# EasyEDA schematic Class AB.json
TITLE: 3T Class AB Audio Amp; REV: 1.0; Date: 2020-02-13; Sheet: 1/1; Drawn By: Ezra W. Wolf; Company: n/a
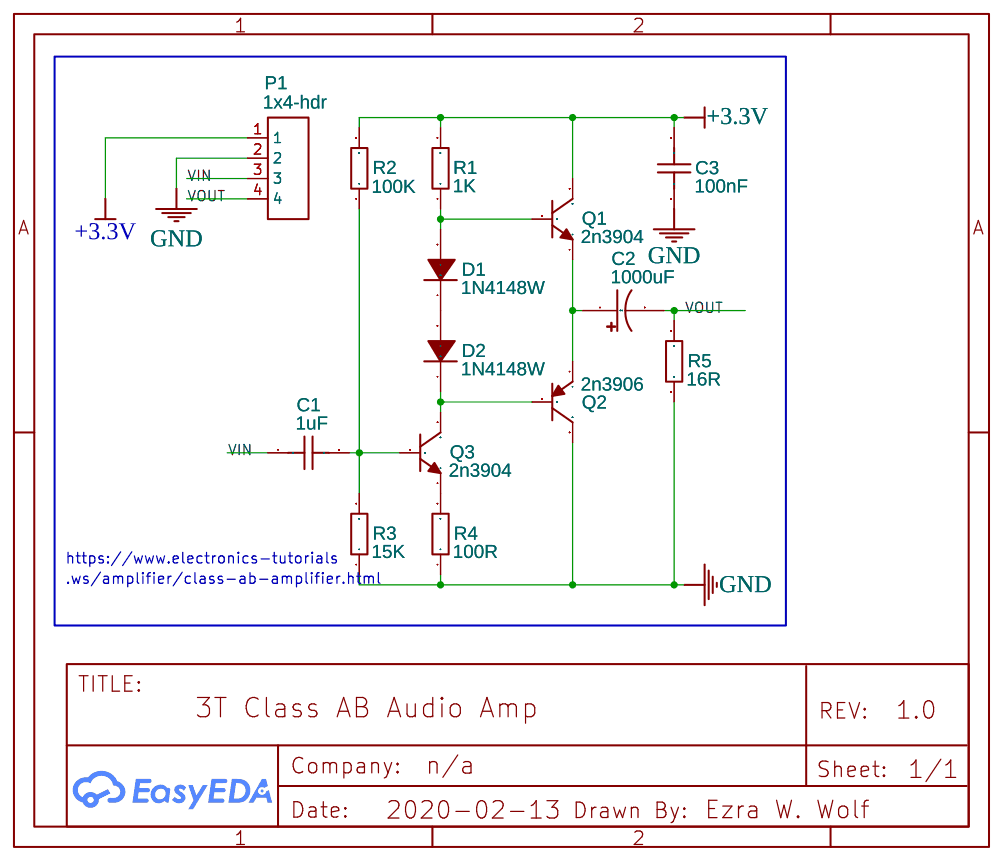
[diagram p0: schematic sheet]

## Parts
#1  -
C1  1uF  [C0603]
C2  1000uF  [CAP-SMD_BD10.0-L10.3-W10.3-FD]
C3  100nF  [C0603]
D1  1N4148W  [SOD-123_L2.8-W1.8-LS3.7-RD]
D2  1N4148W  [SOD-123_L2.8-W1.8-LS3.7-RD]
P1  1x4-hdr  [1X4-HDR]
Q1  2n3904  [SOT-23-3_L2.9-W1.3-P1.90-LS2.4-TR]
Q2  2n3906  [SOT-23-3_L2.9-W1.6-P1.90-LS2.8-TR-CW]
Q3  2n3904  [SOT-23-3_L2.9-W1.3-P1.90-LS2.4-TR]
R1  1K  [R0603]
R2  100K  [R0603]
R3  15K  [R0603]
R4  100R  [R0603]
R5  16R  [R0603]

## Library data of the parts
#1 = -: BOM_Manufacturer Part: ?
C1 = GRM188B31C105KA92D: Supplier: LCSC; Manufacturer: MuRata; Supplier Part: C85993
C2 = VEU102M0J1010-TRO: Supplier: LCSC; Supplier Part: C249735; Manufacturer: Lelon; Contributor: LCSC
C3 = 0603B104M500CT: Supplier: LCSC; Supplier Part: C388001; Manufacturer: Walsin Tech Corp; Contributor: LCSC
D1 D2 = 1N4148W_C109203: Supplier: LCSC; Supplier Part: C109203; Manufacturer: SK; Contributor: LCSC
P1 = 1x4-hdr: Contributor: Ezra Wolf
Q1 Q3 = 2n3904S-RTK/PS_C18536: Supplier: LCSC; Manufacturer: KEC; Manufacturer Part: 2n3904S-RTK/PS; image: //image.lceda.cn/szlcsc/C18536.jpg; Supplier Part: C18536; LCSC Assembly: Yes; SMT Type: Basic
Q2 = 2N3906S-RTK/PS: Supplier: LCSC; Manufacturer: KEC; Contributor: LCSC; Supplier Part: C147294; LCSC Assembly: Yes; SMT Type: Extend
R1 = RMC06031K5%N: Supplier: LCSC; Supplier Part: C269685; Manufacturer: Tyohm; Contributor: LCSC
R2 = R0603RXX104XJ10LTS: Supplier: LCSC; Supplier Part: C267258; Manufacturer: Shenzhen Eyang Tech Development; Contributor: LCSC
R3 = RMC060315K1%N: Supplier: LCSC; Supplier Part: C269703; Manufacturer: Tyohm; Contributor: LCSC
R4 = RMS06FT1000: Supplier: LCSC; Supplier Part: C209011; Manufacturer: TA-I Tech; Contributor: LCSC
R5 = RTT03160JTP: Supplier: LCSC; Manufacturer: RALEC; Contributor: LCSC; Supplier Part: C158940

## Nets
+3.3V: C3.1 P1.1 Q1.3(C) R1.2 R2.2
GND: C3.2 P1.2 Q2.3(C) R3.1 R4.1 R5.2
VIN: C1.1 P1.3
VOUT: C2.2 P1.4 R5.1
Net-(C1-2): C1.2 Q3.2(B) R2.1 R3.2
Net-(C2-1): C2.1 Q1.1(E) Q2.1(E)
Net-(D1-1): D1.1(C) D2.2(A)
Net-(D1-2): D1.2(A) Q1.2(B) R1.1
Net-(D2-1): D2.1(C) Q2.2(B) Q3.3(C)
Net-(Q3-1): Q3.1(E) R4.2

## Notes on the sheet
- https://www.electronics-tutorials
- .ws/amplifier/class-ab-amplifier.html
